# EAGLE schematic dp_tape_cutting_robot-logic (EAGLE 6.3)
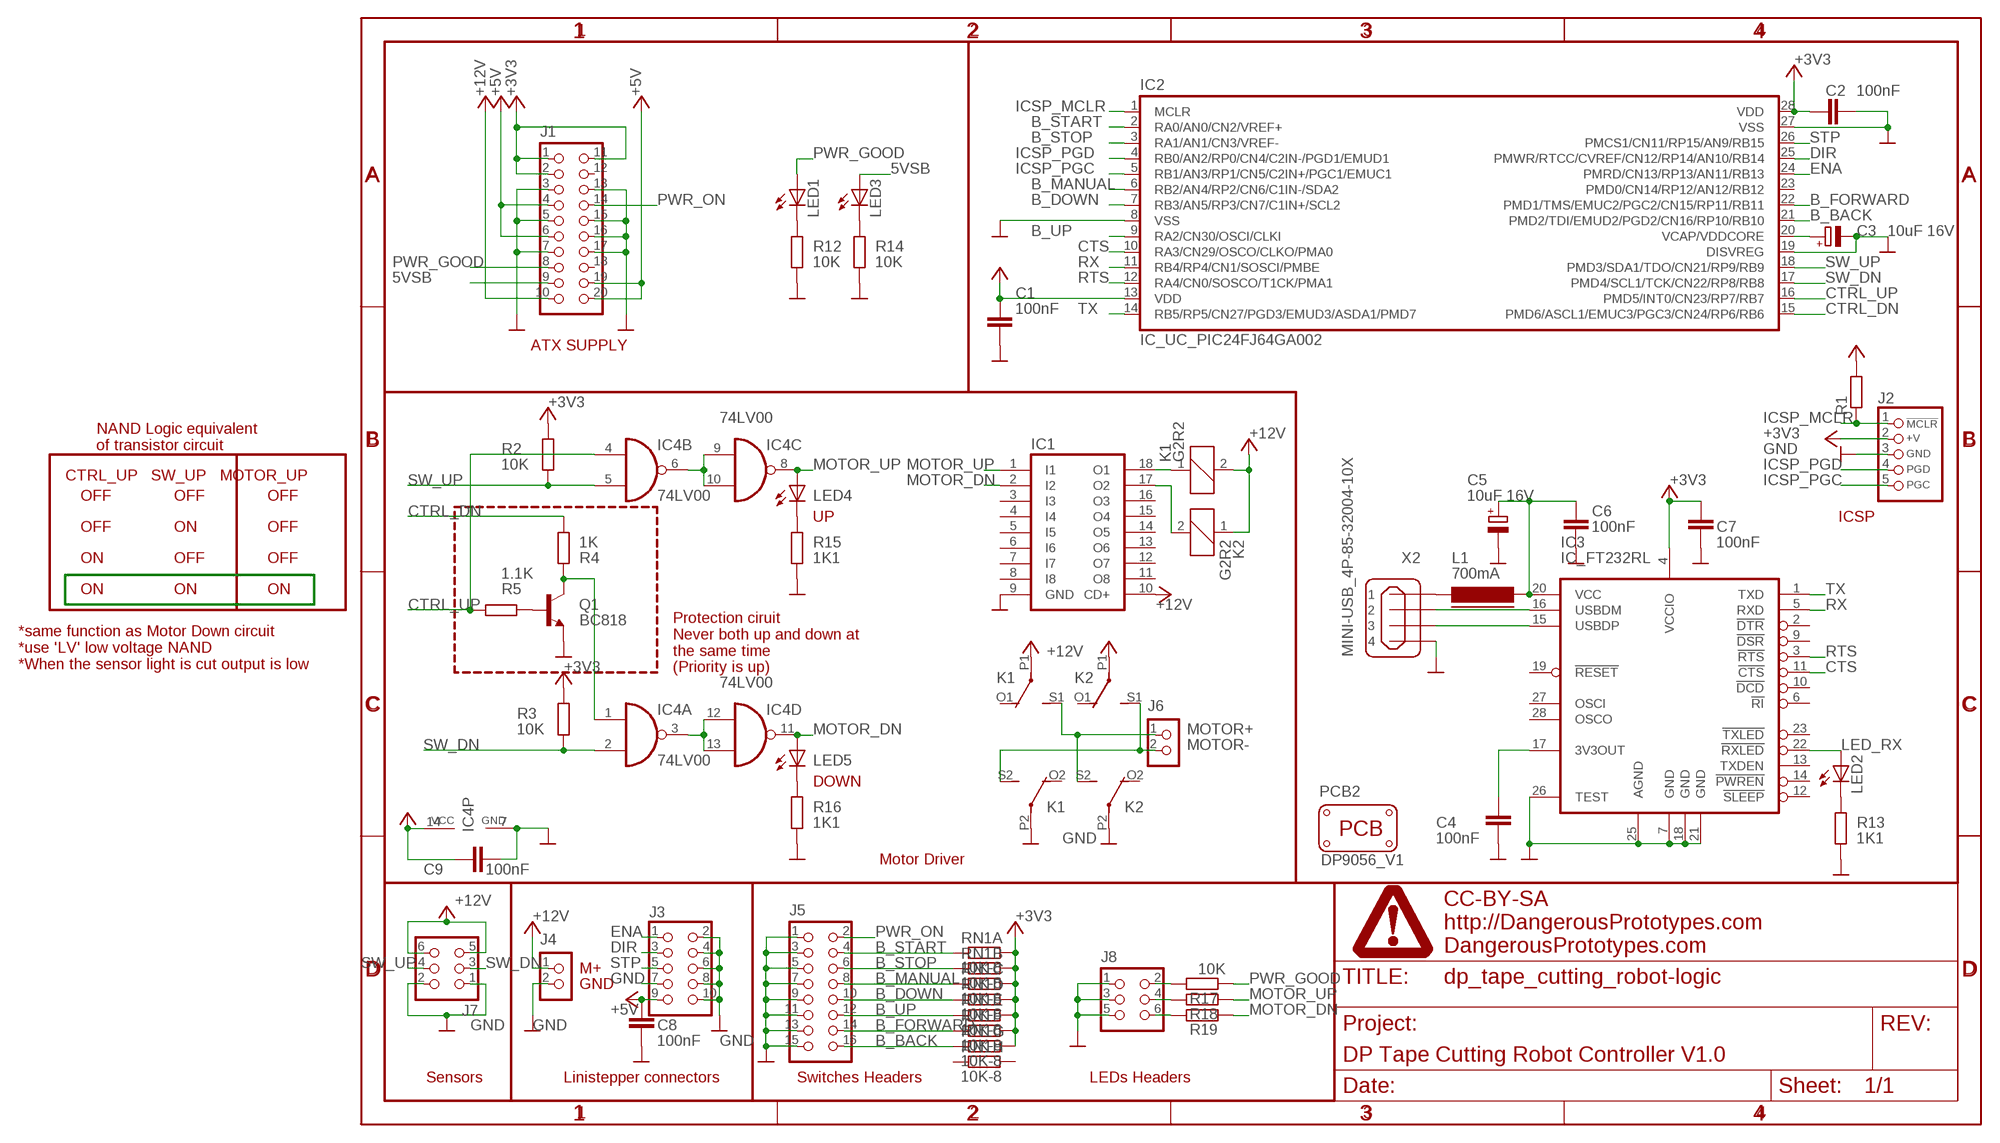
[diagram p0: schematic, sheet 1]

## Parts
C1  100nF  CAPACITOR_NPOL-0603  [C603]
C2  100nF  CAPACITOR_NPOL-0603  [C603]
C3  10uF 16V  CAPACITOR_POL-SMC_A  [SMC_A]
C4  100nF  CAPACITOR_NPOL-0603  [C603]
C5  10uF 16V  CAPACITOR_POL-SMC_A  [SMC_A]
C6  100nF  CAPACITOR_NPOL-0603  [C603]
C7  100nF  CAPACITOR_NPOL-0603  [C603]
C8  100nF  CAPACITOR_NPOL-0603  [C603]
C9  100nF  CAPACITOR_NPOL-0603  [C603]
IC1  IC_ULN2803AN  [DIL18]
IC2  IC_UC_PIC24FJ64GA002  [SSOP-28]
IC3  IC_FT232RL  [SSOP-28]
IC4  74LV00  74AC00D  [SO14]
J1  CON_ATX_PWR-90DEG  [CON_ATX_PWR_90DEG]
J2  CON_HEADER_PRG_PIC_ICSP0.1INCH_A  [HEADER_PRG_1X05]
J3  CON_HEADER_2X05-PTH  [M2X5]
J4  CON_TERMINAL_BLOCK_02-5MM  [TERMINAL_BLOCK_2P_5]
J5  CON_HEADER_2X08  [M2X8]
J6  CON_TERMINAL_BLOCK_02-5MM  [TERMINAL_BLOCK_2P_5]
J7  CON_HEADER_2X03-PTH  [M2X3]
J8  CON_HEADER_2X03-PTH  [M2X3]
K1  G2R2  [G2R2]
K2  G2R2  [G2R2]
L1  700mA  FERRITE-0805  [FB805]
LED1  LED-0805  [LED-805]
LED2  LED-0805  [LED-805]
LED3  LED-0805  [LED-805]
LED4  LED-0805  [LED-805]
LED5  LED-0805  [LED-805]
PCB2  PCB_DP_RECTANGLE-56X90  [DP9056_V1]
Q1  BC818  TRANSISTOR_BJT_NPN-SOT-23-BEC  [SOT-23]
R1  RESISTOR-0603  [R603]
R2  10K  RESISTOR-0603  [R603]
R3  10K  RESISTOR-0603  [R603]
R4  1K  RESISTOR-0603  [R603]
R5  1.1K  RESISTOR-0603  [R603]
R12  10K  RESISTOR-0603  [R603]
R13  1K1  RESISTOR-0603  [R603]
R14  10K  RESISTOR-0603  [R603]
R15  1K1  RESISTOR-0603  [R603]
R16  1K1  RESISTOR-0603  [R603]
R17  10K  RESISTOR-0603  [R603]
R18  RESISTOR-0603  [R603]
R19  RESISTOR-0603  [R603]
RN1  10K-8  RESISTOR_ARRAY_8  [CAT16-F8/CAT16-J8]
U$1  FRAME_DINA4_L  [DP_LOGO]
X2  MINI-USB_4P-85-32004-10X  [85-32004-10X]

## Nets
5VSB: J1.9 LED3.A
+3V3: C1.1 C2.2 C7.2 C9.2 IC2.13(VDD) IC2.28(VDD) IC3.4(VCCIO) IC4.14(P:VCC) J1.1 J1.2 J1.11 J2.2(+V) R1.2 R2.2 R3.2 RN1.10 RN1.11 RN1.12 RN1.13 RN1.14 RN1.15 RN1.16 ; supply symbol labelled SUPPLY_+3V3
+5V: C8.2 J1.4 J1.6 J1.19 J1.20 J3.9 ; supply symbol labelled SUPPLY_+5V
+12V: IC1.10(CD+) J1.10 J4.1 J7.5 J7.6 K1.2 K1.P1(2:P) K2.1 K2.P1(2:P) ; supply symbol labelled SUPPLY_+12V
B_BACK: IC2.21(PMD2/TDI/EMUD2/PGD2/CN16/RP10/RB10) J5.16 RN1.7
B_DOWN: IC2.7(RB3/AN5/RP3/CN7/C1IN+/SCL2) J5.10 RN1.4
B_FORWARD: IC2.22(PMD1/TMS/EMUC2/PGC2/CN15/RP11/RB11) J5.14 RN1.6
B_MANUAL: IC2.6(RB2/AN4/RP2/CN6/C1IN-/SDA2) J5.8 RN1.3
B_START: IC2.2(RA0/AN0/CN2/VREF+) J5.4 RN1.1
B_STOP: IC2.3(RA1/AN1/CN3/VREF-) J5.6 RN1.2
B_UP: IC2.9(RA2/CN30/OSCI/CLKI) J5.12 RN1.5
CTRL_DN: IC2.15(PMD6/ASCL1/EMUC3/PGC3/CN24/RP6/RB6) R4.1
CTRL_UP: IC2.16(PMD5/INT0/CN23/RP7/RB7) IC4.4(B:I0) R5.1
CTS: IC2.10(RA3/CN29/OSCO/CLKO/PMA0) IC3.11(!CTS)
DIR: IC2.25(PMWR/RTCC/CVREF/CN12/RP14/AN10/RB14) J3.3
ENA: IC2.24(PMRD/CN13/RP13/AN11/RB13) J3.1
GND: C1.2 C2.1 C3.- C4.1 C5.- C6.1 C7.1 C8.1 C9.1 IC1.9(GND) IC2.8(VSS) IC2.19(DISVREG) IC2.27(VSS) IC3.7(GND) IC3.18(GND) IC3.21(GND) IC3.25(AGND) IC3.26(TEST) IC4.7(P:GND) J1.3 J1.5 J1.7 J1.13 J1.15 J1.16 J1.17 J2.3(GND) J3.2 J3.4 J3.6 J3.7 J3.8 J3.10 J4.2 J5.1 J5.3 J5.5 J5.7 J5.9 J5.11 J5.13 J5.15 J7.1 J7.2 J8.1 J8.3 J8.5 K1.P2(3:P) K2.P2(3:P) Q1.2(E) R12.1 R13.1 R14.1 R15.1 R16.1 X2.4 ; supply symbol labelled SUPPLY_GND
ICSP_MCLR: IC2.1(MCLR) J2.1(/MCLR) R1.1
ICSP_PGC: IC2.5(RB1/AN3/RP1/CN5/C2IN+/PGC1/EMUC1) J2.5(PGC)
ICSP_PGD: IC2.4(RB0/AN2/RP0/CN4/C2IN-/PGD1/EMUD1) J2.4(PGD)
LED_RX: IC3.22(!RXLED) LED2.A
MOTOR+: J6.1 K1.S1(2:S) K2.S2(3:S)
MOTOR-: J6.2 K1.S2(3:S) K2.S1(2:S)
MOTOR_DN: IC1.2(I2) IC4.11(D:O) LED5.A R19.1
MOTOR_UP: IC1.1(I1) IC4.8(C:O) LED4.A R18.1
N$1: C3.+ IC2.20(VCAP/VDDCORE)
N$2: IC1.17(O2) K2.2
N$4: IC4.3(A:O) IC4.12(D:I0) IC4.13(D:I1)
N$5: LED1.C R12.2
N$6: IC4.1(A:I0) Q1.3(C) R4.2
N$7: Q1.1(B) R5.2
N$9: LED2.C R13.2
N$11: C4.2 IC3.17(3V3OUT)
N$12: LED3.C R14.2
N$13: LED4.C R15.2
N$14: LED5.C R16.2
N$15: IC1.18(O1) K1.1
N$17: IC3.16(USBDM) X2.2
N$18: IC3.15(USBDP) X2.3
N$19: C5.+ C6.2 IC3.20(VCC) L1.2
N$20: L1.1 X2.1
N$24: IC4.6(B:O) IC4.9(C:I0) IC4.10(C:I1)
N$27: J8.2 R17.2
N$29: J8.4 R18.2
N$30: J8.6 R19.2
PWR_GOOD: J1.8 LED1.A R17.1
PWR_ON: J1.14 J5.2
RTS: IC2.12(RA4/CN0/SOSCO/T1CK/PMA1) IC3.3(!RTS)
RX: IC2.11(RB4/RP4/CN1/SOSCI/PMBE) IC3.5(RXD)
STP: IC2.26(PMCS1/CN11/RP15/AN9/RB15) J3.5
SW_DN: IC2.17(PMD4/SCL1/TCK/CN22/RP8/RB8) IC4.2(A:I1) J7.3 R3.1
SW_UP: IC2.18(PMD3/SDA1/TDO/CN21/RP9/RB9) IC4.5(B:I1) J7.4 R2.1
TX: IC2.14(RB5/RP5/CN27/PGD3/EMUD3/ASDA1/PMD7) IC3.1(TXD)
Unconnected: IC1.3(I3) IC1.4(I4) IC1.5(I5) IC1.6(I6) IC1.7(I7) IC1.8(I8) IC1.11(O8) IC1.12(O7) IC1.13(O6) IC1.14(O5) IC1.15(O4) IC1.16(O3) IC2.23(PMD0/CN14/RP12/AN12/RB12) IC3.2(!DTR) IC3.6(!RI) IC3.9(!DSR) IC3.10(!DCD) IC3.12(!SLEEP) IC3.13(TXDEN) IC3.14(!PWREN) IC3.19(!RESET) IC3.23(!TXLED) IC3.27(OSCI) IC3.28(OSCO) J1.12 J1.18 K1.O1(2:O) K1.O2(3:O) K2.O1(2:O) K2.O2(3:O) RN1.8 RN1.9

## Notes on the sheet
- ATX SUPPLY
- NAND Logic equivalent
  of transistor circuit
- CTRL_UP   SW_UP   MOTOR_UP
- OFF | OFF | OFF
- UP | ICSP
- OFF | ON | OFF
- ON | OFF | OFF
- ON | ON | ON
- *same function as Motor Down circuit
  *use 'LV' low voltage NAND
  *When the sensor light is cut output is low
- Protection ciruit
  Never both up and down at
  the same time
  (Priority is up)
- DOWN
- Motor Driver
- M+
- GND
- Sensors | Linistepper connectors | Switches Headers | LEDs Headers

## Library data of the parts
C1 C2 C4 C6-C9 = dp_devices:CAPACITOR_NPOL: Non-Polarized capacitor in various packages
C3 C5 = dp_devices:CAPACITOR_POL: Polarized capacitor in various packages
IC1 = dp_devices:IC_ULN2803A: DRIVER ARRAY
IC2 = dp_devices:IC_UC_PIC24FJ64GA002: 16-bit General Purpose Flash Microcontroller
IC3 = dp_devices:IC_FT232RL: USB to serial UART interface
IC4 = 74xx-eu:74*00: Quad 2-input NAND gate
J1 = dp_devices:CON_ATX_PWR
J2 = dp_devices:CON_HEADER_PRG_PIC_ICSP: 5-pin PIC In Circuit Serial Programming header
J3 = dp_devices:CON_HEADER_2X05: 2x05 pin header
J4 J6 = dp_devices:CON_TERMINAL_BLOCK_02: 2 poles wire to board terminal block
J5 = dp_devices:CON_HEADER_2X08
J7 J8 = dp_devices:CON_HEADER_2X03
K1 K2 = relay:G2R2: RELAY 2 x switch, Omron; MF: OMRON COMPONENTS USA; MPN: G2R-2-DC6; OC_FARNELL: unknown; OC_NEWARK: 89C5317
L1 = dp_devices:FERRITE: Ferrite bead in various packages
LED1-LED5 = dp_devices:LED: Light Emitting Diode
PCB2 = dp_devices:PCB_DP_RECTANGLE: Dangerous Prototypes Standard Rectangular PCB sizes; PCB_SIZE: DP9056_V1
Q1 = dp_devices:TRANSISTOR_BJT_NPN: Most commonly used is SOT23-BEC
R1-R5 R12-R19 = dp_devices:RESISTOR
RN1 = dp_devices:RESISTOR_ARRAY_8
U$1 = dp_devices:FRAME_DINA4_L: A4 DP frame Standard Dangerous Prototypes schematic frame. Automagically adds the DP logo and standard texts to the PCB Use the atrribute in the schematic editor to change the fields.; LICENSE: CC-BY-SA; PROJECT: DP Tape Cutting Robot Controller V1.0; URL1: http://DangerousPrototypes.com; URL2: DangerousPrototypes.com
X2 = con-cypressindustries:MINI-USB_4P-: MINI USB 4 Pol. Source: www.cypressindustries.com; OC_FARNELL: unknown; OC_NEWARK: unknown